# Altium schematic sheet MCU.SchDoc
size A4; SheetNumber: 2; SheetTotal: 9
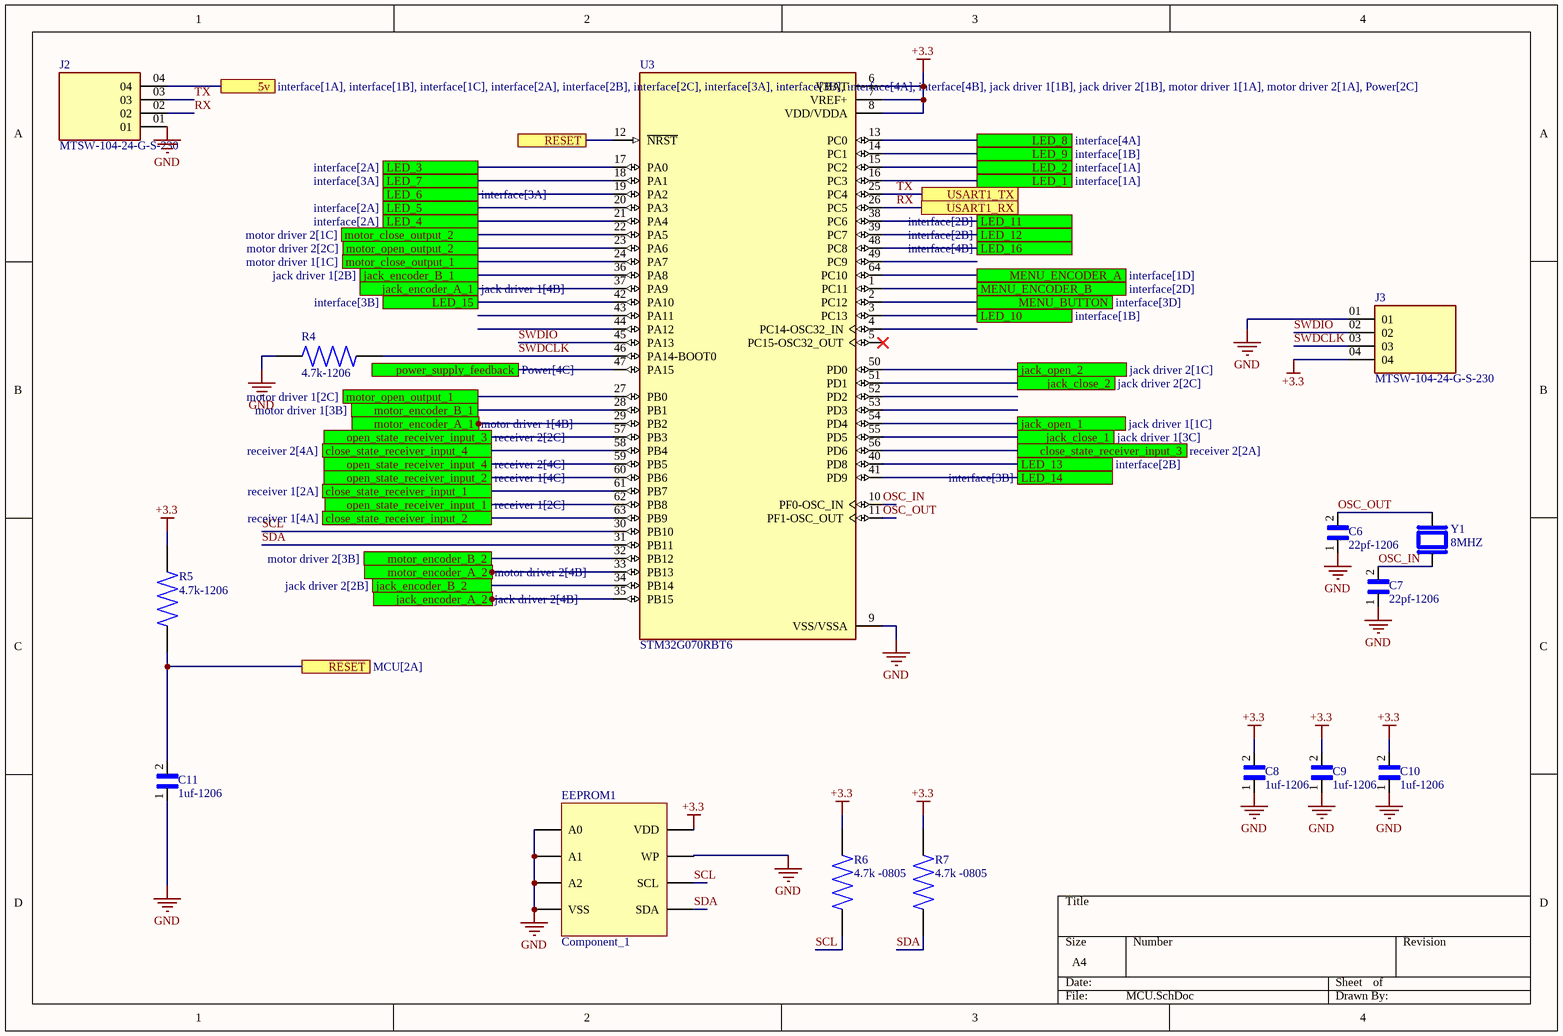
[diagram p0: MCU.SchDoc]

## Parts
C6  22pf-1206  [CAPC3216X180N]
C7  22pf-1206  [CAPC3216X180N]
C8  1uf-1206  [CAPC3216X180N]
C9  1uf-1206  [CAPC3216X180N]
C10  1uf-1206  [CAPC3216X180N]
C11  1uf-1206  [CAPC3216X180N]
EEPROM1  Component_1  [SOIC127P602X172-8N]
J2  MTSW-104-24-G-S-230  [SAMTEC_MTSW-104-24-G-S-230]
J3  MTSW-104-24-G-S-230  [SAMTEC_MTSW-104-24-G-S-230]
R4  4.7k-1206  [RESC3015X65N]
R5  4.7k-1206  [RESC3015X65N]
R6  4.7k -0805  [RESC2012X65N]
R7  4.7k -0805  [RESC2012X65N]
U3  STM32G070RBT6  [QFP50P1200X1200X160-64N]
Y1  8MHZ  [XTAL_ABLS2-12.000MHZ-D4Y-T]

## Ports
5v (see interface[1A], interface[1B], interface[1C], interface[2A], interface[2B], interface[2C], interface[3A], interface[3B], interface[4A], interface[4B], jack driver 1[1B], jack driver 2[1B], motor driver 1[1A], motor driver 2[1A], Power[2C]), close_state_receiver_input_1 (see receiver 1[2A]), close_state_receiver_input_2 (see receiver 1[4A]), close_state_receiver_input_3 (see receiver 2[2A]), close_state_receiver_input_4 (see receiver 2[4A]), jack_close_1 (see jack driver 1[3C]), jack_close_2 (see jack driver 2[2C]), jack_encoder_A_1 (see jack driver 1[4B]), jack_encoder_A_2 (see jack driver 2[4B]), jack_encoder_B_1 (see jack driver 1[2B]), jack_encoder_B_2 (see jack driver 2[2B]), jack_open_1 (see jack driver 1[1C]), jack_open_2 (see jack driver 2[1C]), LED_1 (see interface[1A]), LED_2 (see interface[1A]), LED_3 (see interface[2A]), LED_4 (see interface[2A]), LED_5 (see interface[2A]), LED_6 (see interface[3A]), LED_7 (see interface[3A]), LED_8 (see interface[4A]), LED_9 (see interface[1B]), LED_10 (see interface[1B]), LED_11 (see interface[2B]), LED_12 (see interface[2B]), LED_13 (see interface[2B]), LED_14 (see interface[3B]), LED_15 (see interface[3B]), LED_16 (see interface[4B]), MENU_BUTTON (see interface[3D]), MENU_ENCODER_A (see interface[1D]), MENU_ENCODER_B (see interface[2D]), motor_close_output_1 (see motor driver 1[1C]), motor_close_output_2 (see motor driver 2[1C]), motor_encoder_A_1 (see motor driver 1[4B]), motor_encoder_A_2 (see motor driver 2[4B]), motor_encoder_B_1 (see motor driver 1[3B]), motor_encoder_B_2 (see motor driver 2[3B]), motor_open_output_1 (see motor driver 1[2C]), motor_open_output_2 (see motor driver 2[2C]), open_state_receiver_input_1 (see receiver 1[2C]), open_state_receiver_input_2 (see receiver 1[4C]), open_state_receiver_input_3 (see receiver 2[2C]), open_state_receiver_input_4 (see receiver 2[4C]), power_supply_feedback (see Power[4C]), RESET (see MCU[1C]), RESET (see MCU[2A]), USART1_RX, USART1_TX

## Nets
+3.3: C8.2 C9.2 C10.2 EEPROM1.7(VDD) J3.04 R5.2 R6.2 R7.2 U3.6(VBAT) U3.7(VREF+) U3.8(VDD/VDDA)
GND: C6.1 C7.1 C8.1 C9.1 C10.1 C11.1 EEPROM1.0(A0) EEPROM1.1(A1) EEPROM1.2(A2) EEPROM1.3(VSS) EEPROM1.6(WP) J2.01 J3.01 R4.2 U3.9(VSS/VSSA)
5v: J2.04 ; port 5v
close_state_receiver_input_1: U3.61(PB7) ; port close_state_receiver_input_1
close_state_receiver_input_2: U3.63(PB9) ; port close_state_receiver_input_2
close_state_receiver_input_3: U3.56(PD6) ; port close_state_receiver_input_3
close_state_receiver_input_4: U3.58(PB4) ; port close_state_receiver_input_4
jack_close_1: U3.55(PD5) ; port jack_close_1
jack_close_2: U3.51(PD1) ; port jack_close_2
jack_encoder_A_1: U3.37(PA9) ; port jack_encoder_A_1
jack_encoder_A_2: U3.35(PB15) ; port jack_encoder_A_2
jack_encoder_B_1: U3.36(PA8) ; port jack_encoder_B_1
jack_encoder_B_2: U3.34(PB14) ; port jack_encoder_B_2
jack_open_1: U3.54(PD4) ; port jack_open_1
jack_open_2: U3.50(PD0) ; port jack_open_2
LED_1: U3.16(PC3) ; port LED_1
LED_2: U3.15(PC2) ; port LED_2
LED_3: U3.17(PA0) ; port LED_3
LED_4: U3.21(PA4) ; port LED_4
LED_5: U3.20(PA3) ; port LED_5
LED_6: U3.19(PA2) ; port LED_6
LED_7: U3.18(PA1) ; port LED_7
LED_8: U3.13(PC0) ; port LED_8
LED_9: U3.14(PC1) ; port LED_9
LED_10: U3.3(PC13) ; port LED_10
LED_11: U3.38(PC6) ; port LED_11
LED_12: U3.39(PC7) ; port LED_12
LED_13: U3.40(PD8) ; port LED_13
LED_14: U3.41(PD9) ; port LED_14
LED_15: U3.42(PA10) ; port LED_15
LED_16: U3.48(PC8) ; port LED_16
MENU_BUTTON: U3.2(PC12) ; port MENU_BUTTON
MENU_ENCODER_A: U3.64(PC10) ; port MENU_ENCODER_A
MENU_ENCODER_B: U3.1(PC11) ; port MENU_ENCODER_B
motor_close_output_1: U3.24(PA7) ; port motor_close_output_1
motor_close_output_2: U3.22(PA5) ; port motor_close_output_2
motor_encoder_A_1: U3.29(PB2) ; port motor_encoder_A_1
motor_encoder_A_2: U3.33(PB13) ; port motor_encoder_A_2
motor_encoder_B_1: U3.28(PB1) ; port motor_encoder_B_1
motor_encoder_B_2: U3.32(PB12) ; port motor_encoder_B_2
motor_open_output_1: U3.27(PB0) ; port motor_open_output_1
motor_open_output_2: U3.23(PA6) ; port motor_open_output_2
open_state_receiver_input_1: U3.62(PB8) ; port open_state_receiver_input_1
open_state_receiver_input_2: U3.60(PB6) ; port open_state_receiver_input_2
open_state_receiver_input_3: U3.57(PB3) ; port open_state_receiver_input_3
open_state_receiver_input_4: U3.59(PB5) ; port open_state_receiver_input_4
OSC_IN: C7.2 U3.10(PF0-OSC_IN) Y1.1
OSC_OUT: C6.2 U3.11(PF1-OSC_OUT) Y1.2
power_supply_feedback: U3.47(PA15) ; port power_supply_feedback
RESET: C11.2 R5.1 U3.12(~{NRST}) ; port RESET
RX: J2.02 U3.26(PC5) ; port USART1_RX
SCL: EEPROM1.5(SCL) R6.1 U3.30(PB10)
SDA: EEPROM1.4(SDA) R7.1 U3.31(PB11)
SWDCLK: J3.03 R4.1 U3.46(PA14-BOOT0)
SWDIO: J3.02 U3.45(PA13)
TX: J2.03 U3.25(PC4) ; port USART1_TX

Not connected (* = marked no-connect by the designer): U3 4(PC14-OSC32_IN) 5(PC15-OSC32_OUT)* 43(PA11) 44(PA12) 49(PC9) 52(PD2) 53(PD3)

## Library data of the parts
C6-C11 = CGA5L3X8R1H105M160AB: 1ÂµF Â±20% 50V Ceramic Capacitor X8R 1206 (3216 Metric); MF: TDK; Value: *; Purchase-URL: https://pricing.snapeda.com/search/part/CGA5L3X8R1H105M160AB/?ref=eda; Package: 3216 TDK; Availability: In Stock; SnapEDA_Link: https://www.snapeda.com/parts/CGA5L3X8R1H105M160AB/TDK/view-part/?ref=snap; MP: CGA5L3X8R1H105M160AB; Check_prices: https://www.snapeda.com/parts/CGA5L3X8R1H105M160AB/TDK/view-part/?ref=eda; Price: None
R4 R5 = CPF1206B10KE1: Res Thin Film 1206 10K Ohm 0.1% 1/8W Â±25ppm/Â°C Molded SMD SMD Paper T/R; Power_Rating: .125 W; MF: TE Connectivity; Voltage_Rating: 150 V; Tolerance: .1%; SnapEDA_Link: https://www.snapeda.com/parts/CPF1206B10KE1/TE+Connectivity/view-part/?ref=snap; Package: 1206; Resistance: 10K; Value: *; MP: CPF1206B10KE1; EU_RoHS_Compliance: Compliant; Check_prices: https://www.snapeda.com/parts/CPF1206B10KE1/TE+Connectivity/view-part/?ref=eda
R6 R7 = CRGCQ0805J470R: Fixed Resistor CRGCQ 0805 470R 5%; MF: TE Connectivity; SnapEDA_Link: https://www.snapeda.com/parts/CRGCQ0805J470R/TE+Connectivity/view-part/?ref=snap; Package: 2012 TE Connectivity; Value: *; MP: CRGCQ0805J470R; Check_prices: https://www.snapeda.com/parts/CRGCQ0805J470R/TE+Connectivity/view-part/?ref=eda
U3 = STM32G070RBT6: ARMÂ® CortexÂ®-M0+ STM32G0 Microcontroller IC 32-Bit Single-Core 64MHz 128KB (128K x 8) FLASH 64-LQFP (10x10); MF: STMicroelectronics; SnapEDA_Link: https://www.snapeda.com/parts/STM32G070RBT6/STMicroelectronics/view-part/?ref=snap; Package: LQFP-64 STMicroelectronics; Value: *; MP: STM32G070RBT6; Check_prices: https://www.snapeda.com/parts/STM32G070RBT6/STMicroelectronics/view-part/?ref=eda
Y1 = ABLS2-12.000MHZ-D4Y-T: HC/49US (AT49) LOW PROFILE SURFACE MOUNT MICROPROCESSOR CRYSTAL; MF: Abracon; Purchase-URL: https://pricing.snapeda.com/search/part/ABLS2-12.000MHZ-D4Y-T/?ref=eda; Package: HC49/US Abracon; MP: ABLS2-12.000MHZ-D4Y-T; Value: *; Price: None; Availability: In Stock; SnapEDA_Link: https://www.snapeda.com/parts/ABLS2-12.000MHZ-D4Y-T/Abracon+LLC/view-part/?ref=snap; Check_prices: https://www.snapeda.com/parts/ABLS2-12.000MHZ-D4Y-T/Abracon+LLC/view-part/?ref=eda
J2 J3 = MTSW-104-24-G-S-230: Price: None; Value: *; Package: None; Availability: Unavailable; MP: MTSW-104-24-G-S-230